# Altium schematic sheet Rene_Panel_schematic.SchDoc
size A3
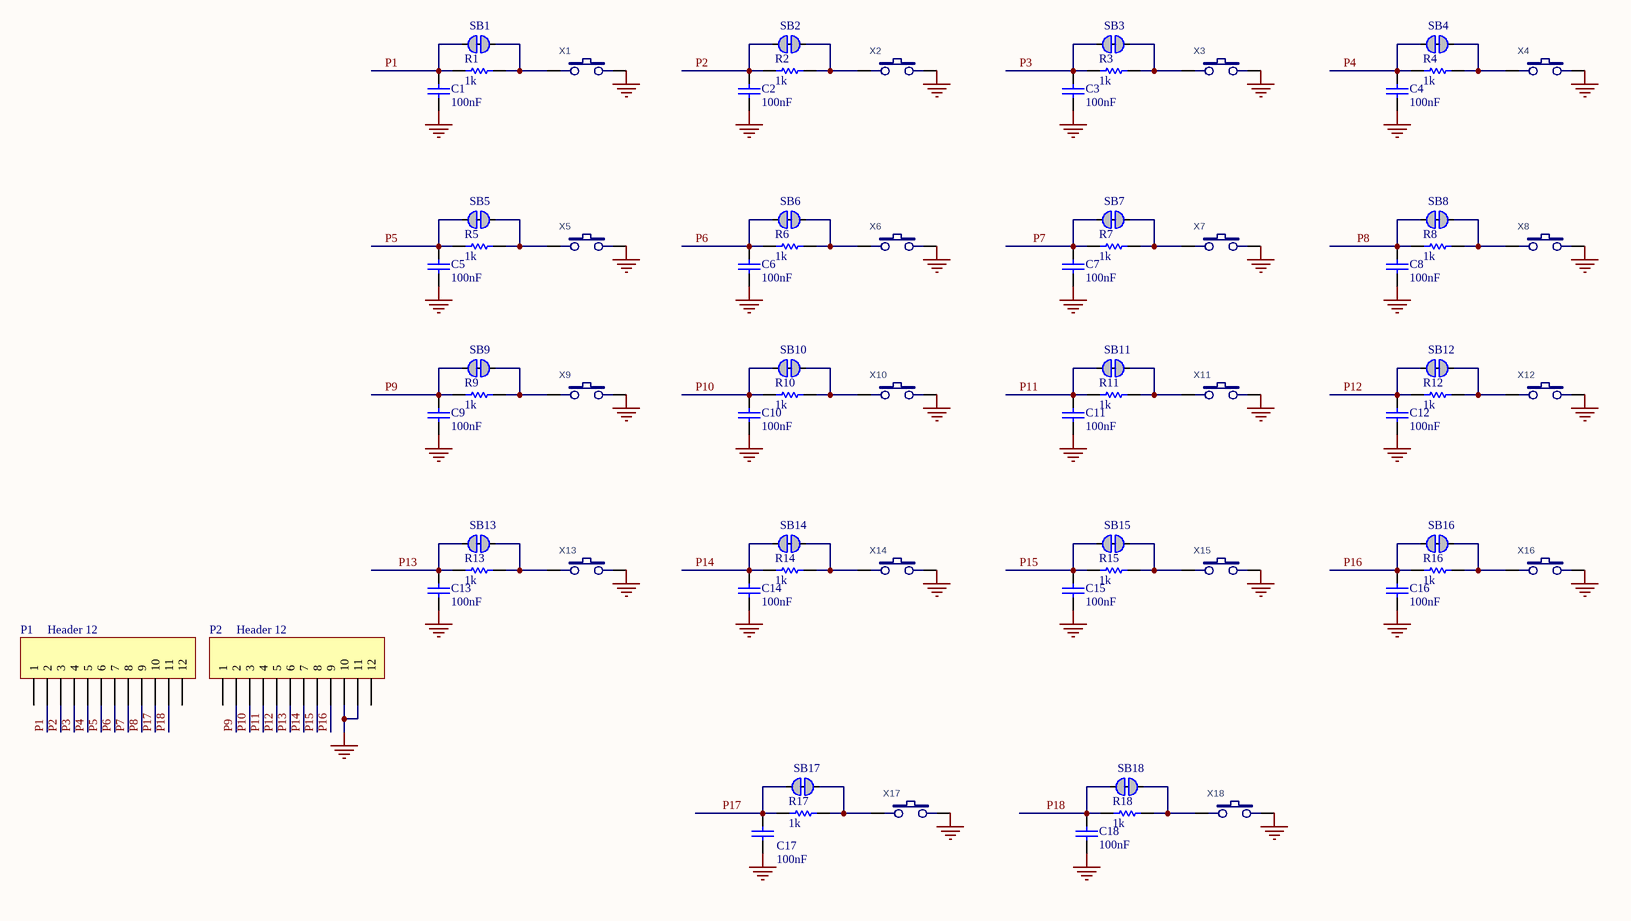
[diagram p0: Rene_Panel_schematic.SchDoc]

## Parts
C1  100nF  [CAPA_0805]
C2  100nF  [CAPA_0805]
C3  100nF  [CAPA_0805]
C4  100nF  [CAPA_0805]
C5  100nF  [CAPA_0805]
C6  100nF  [CAPA_0805]
C7  100nF  [CAPA_0805]
C8  100nF  [CAPA_0805]
C9  100nF  [CAPA_0805]
C10  100nF  [CAPA_0805]
C11  100nF  [CAPA_0805]
C12  100nF  [CAPA_0805]
C13  100nF  [CAPA_0805]
C14  100nF  [CAPA_0805]
C15  100nF  [CAPA_0805]
C16  100nF  [CAPA_0805]
C17  100nF  [CAPA_0805]
C18  100nF  [CAPA_0805]
P1  Header 12  [LIST_1x12_SMD]
P2  Header 12  [LIST_1x12_SMD]
R1  1k  [RES_0805]
R2  1k  [RES_0805]
R3  1k  [RES_0805]
R4  1k  [RES_0805]
R5  1k  [RES_0805]
R6  1k  [RES_0805]
R7  1k  [RES_0805]
R8  1k  [RES_0805]
R9  1k  [RES_0805]
R10  1k  [RES_0805]
R11  1k  [RES_0805]
R12  1k  [RES_0805]
R13  1k  [RES_0805]
R14  1k  [RES_0805]
R15  1k  [RES_0805]
R16  1k  [RES_0805]
R17  1k  [RES_0805]
R18  1k  [RES_0805]
SB1  Solderbridge  [Solderbridge_Shorted]  (value not drawn)  (net tie, no BOM)
SB2  Solderbridge  [Solderbridge_Shorted]  (value not drawn)  (net tie, no BOM)
SB3  Solderbridge  [Solderbridge_Shorted]  (value not drawn)  (net tie, no BOM)
SB4  Solderbridge  [Solderbridge_Shorted]  (value not drawn)  (net tie, no BOM)
SB5  Solderbridge  [Solderbridge_Shorted]  (value not drawn)  (net tie, no BOM)
SB6  Solderbridge  [Solderbridge_Shorted]  (value not drawn)  (net tie, no BOM)
SB7  Solderbridge  [Solderbridge_Shorted]  (value not drawn)  (net tie, no BOM)
SB8  Solderbridge  [Solderbridge_Shorted]  (value not drawn)  (net tie, no BOM)
SB9  Solderbridge  [Solderbridge_Shorted]  (value not drawn)  (net tie, no BOM)
SB10  Solderbridge  [Solderbridge_Shorted]  (value not drawn)  (net tie, no BOM)
SB11  Solderbridge  [Solderbridge_Shorted]  (value not drawn)  (net tie, no BOM)
SB12  Solderbridge  [Solderbridge_Shorted]  (value not drawn)  (net tie, no BOM)
SB13  Solderbridge  [Solderbridge_Shorted]  (value not drawn)  (net tie, no BOM)
SB14  Solderbridge  [Solderbridge_Shorted]  (value not drawn)  (net tie, no BOM)
SB15  Solderbridge  [Solderbridge_Shorted]  (value not drawn)  (net tie, no BOM)
SB16  Solderbridge  [Solderbridge_Shorted]  (value not drawn)  (net tie, no BOM)
SB17  Solderbridge  [Solderbridge_Shorted]  (value not drawn)  (net tie, no BOM)
SB18  Solderbridge  [Solderbridge_Shorted]  (value not drawn)  (net tie, no BOM)
X1  101-0124-EV  [Tactile_switch_12mm_TH]  (value not drawn)
X2  101-0124-EV  [Tactile_switch_12mm_TH]  (value not drawn)
X3  101-0124-EV  [Tactile_switch_12mm_TH]  (value not drawn)
X4  101-0124-EV  [Tactile_switch_12mm_TH]  (value not drawn)
X5  101-0124-EV  [Tactile_switch_12mm_TH]  (value not drawn)
X6  101-0124-EV  [Tactile_switch_12mm_TH]  (value not drawn)
X7  101-0124-EV  [Tactile_switch_12mm_TH]  (value not drawn)
X8  101-0124-EV  [Tactile_switch_12mm_TH]  (value not drawn)
X9  101-0124-EV  [Tactile_switch_12mm_TH]  (value not drawn)
X10  101-0124-EV  [Tactile_switch_12mm_TH]  (value not drawn)
X11  101-0124-EV  [Tactile_switch_12mm_TH]  (value not drawn)
X12  101-0124-EV  [Tactile_switch_12mm_TH]  (value not drawn)
X13  101-0124-EV  [Tactile_switch_12mm_TH]  (value not drawn)
X14  101-0124-EV  [Tactile_switch_12mm_TH]  (value not drawn)
X15  101-0124-EV  [Tactile_switch_12mm_TH]  (value not drawn)
X16  101-0124-EV  [Tactile_switch_12mm_TH]  (value not drawn)
X17  PTS645SM43SMTR 92 LFS  [Tactile_switch_6mm_TH]  (value not drawn)
X18  PTS645SM43SMTR 92 LFS  [Tactile_switch_6mm_TH]  (value not drawn)

## Nets
GND: C1.1 C2.1 C3.1 C4.1 C5.1 C6.1 C7.1 C8.1 C9.1 C10.1 C11.1 C12.1 C13.1 C14.1 C15.1 C16.1 C17.1 C18.1 P2.10 P2.11 X1.2(B) X2.2(B) X3.2(B) X4.2(B) X5.2(B) X6.2(B) X7.2(B) X8.2(B) X9.2(B) X10.2(B) X11.2(B) X12.2(B) X13.2(B) X14.2(B) X15.2(B) X16.2(B) X17.2(B) X18.2(B)
P1: C1.2 P1.2 R1.1 SB1.2
P2: C2.2 P1.3 R2.1 SB2.2
P3: C3.2 P1.4 R3.1 SB3.2
P4: C4.2 P1.5 R4.1 SB4.2
P5: C5.2 P1.6 R5.1 SB5.2
P6: C6.2 P1.7 R6.1 SB6.2
P7: C7.2 P1.8 R7.1 SB7.2
P8: C8.2 P1.9 R8.1 SB8.2
P9: C9.2 P2.2 R9.1 SB9.2
P10: C10.2 P2.3 R10.1 SB10.2
P11: C11.2 P2.4 R11.1 SB11.2
P12: C12.2 P2.5 R12.1 SB12.2
P13: C13.2 P2.6 R13.1 SB13.2
P14: C14.2 P2.7 R14.1 SB14.2
P15: C15.2 P2.8 R15.1 SB15.2
P16: C16.2 P2.9 R16.1 SB16.2
P17: C17.2 P1.10 R17.1 SB17.2
P18: C18.2 P1.11 R18.1 SB18.2
NetR1_2: R1.2 SB1.1 X1.1(A)
NetR2_2: R2.2 SB2.1 X2.1(A)
NetR3_2: R3.2 SB3.1 X3.1(A)
NetR4_2: R4.2 SB4.1 X4.1(A)
NetR5_2: R5.2 SB5.1 X5.1(A)
NetR6_2: R6.2 SB6.1 X6.1(A)
NetR7_2: R7.2 SB7.1 X7.1(A)
NetR8_2: R8.2 SB8.1 X8.1(A)
NetR9_2: R9.2 SB9.1 X9.1(A)
NetR10_2: R10.2 SB10.1 X10.1(A)
NetR11_2: R11.2 SB11.1 X11.1(A)
NetR12_2: R12.2 SB12.1 X12.1(A)
NetR13_2: R13.2 SB13.1 X13.1(A)
NetR14_2: R14.2 SB14.1 X14.1(A)
NetR15_2: R15.2 SB15.1 X15.1(A)
NetR16_2: R16.2 SB16.1 X16.1(A)
NetR17_2: R17.2 SB17.1 X17.1(A)
NetR18_2: R18.2 SB18.1 X18.1(A)

Not connected (* = marked no-connect by the designer): P1 1 12; P2 1 12

## Notes on the sheet
- Title
- Size:
- Date:
- A3
- Number:
- Time:
- Revision:
- Sheet
- of
- File:

## Library data of the parts
C1-C18 = Capacitor: 100nF 0805; PartNumber: 885012207072; Value: 100nF; Mouser: http://www.mouser.de/ProductDetail/Wurth-Electronics/885012207072/?qs=sGAEpiMZZMs0AnBnWHyRQEGbLOF2VP1ibTWUyjubWr0tPlz%2f3fbAWQ%3d%3d
P1 P2 = Header 12: Header, 12-Pin; LatestRevisionDate: 17-Jul-2002; LatestRevisionNote: Re-released for DXP Platform.; Publisher: Altium Limited
R1-R18 = Resistor: 10k 0805; PartNumber: RR1220P-103-D; Manufacturer: Susumu; Value: 1k; Mouser: http://www.mouser.de/ProductDetail/Susumu/RR1220P-103-D/?qs=sGAEpiMZZMu61qfTUdNhG%2fDhcyQpRg8MdkVTtHR2gV4%3d
SB1-SB18 = SOLDERBRIDGE_SHORTED: Shorted Solderbridge; Part Number: Solderbridge Shorted; Artikkelnr Noca: N.A.; Manufacturer: *; Manufacturer Part Number: *; Datasheet: *; LatestRevisionDate: 2012-08-07; Pin Count: 2; Publisher: Nordic Semiconductor; Published: 2012-08-07; Value: Solderbridge; Note: *; Supplier: *; Supplier part number: *; 2nd source Supplier: *; 2nd source part number: *; Footprint Doc: Solderbridge_Shorted; Artikkelnr Simpro: N.A.
X1-X16 = SWITCH/Push Button-EVPAWBA2A: Push Button SMD EVPAWBA2A; Manufacturer: Mountain Switch; Mouser: http://www.mouser.de/ProductDetail/Mountain-Switch/101-0124-EV/?qs=%2fha2pyFadugyCNAhIStjRh4o9JIzyQM7dCKObtyroRU%3d; PartNumber: 101-0124-EV
X17 X18 = SWITCH/Push Button-EVPAWBA2A: Push Button SMD EVPAWBA2A; Manufacturer: C&K Components; Mouser: http://www.mouser.de/ProductDetail/CK-Components/PTS645SM43SMTR-92-LFS/?qs=%2fha2pyFadug0Azfe8RMwGSYmKCJckqYIWMcwD6l1nrwDsL%252b1QhwZ%2fZ403JZA6uFq; PartNumber: PTS645SM43SMTR 92 LFS